# Altium schematic sheet P8_CCD_CAM_BOARD_COMM.SchDoc
size A3
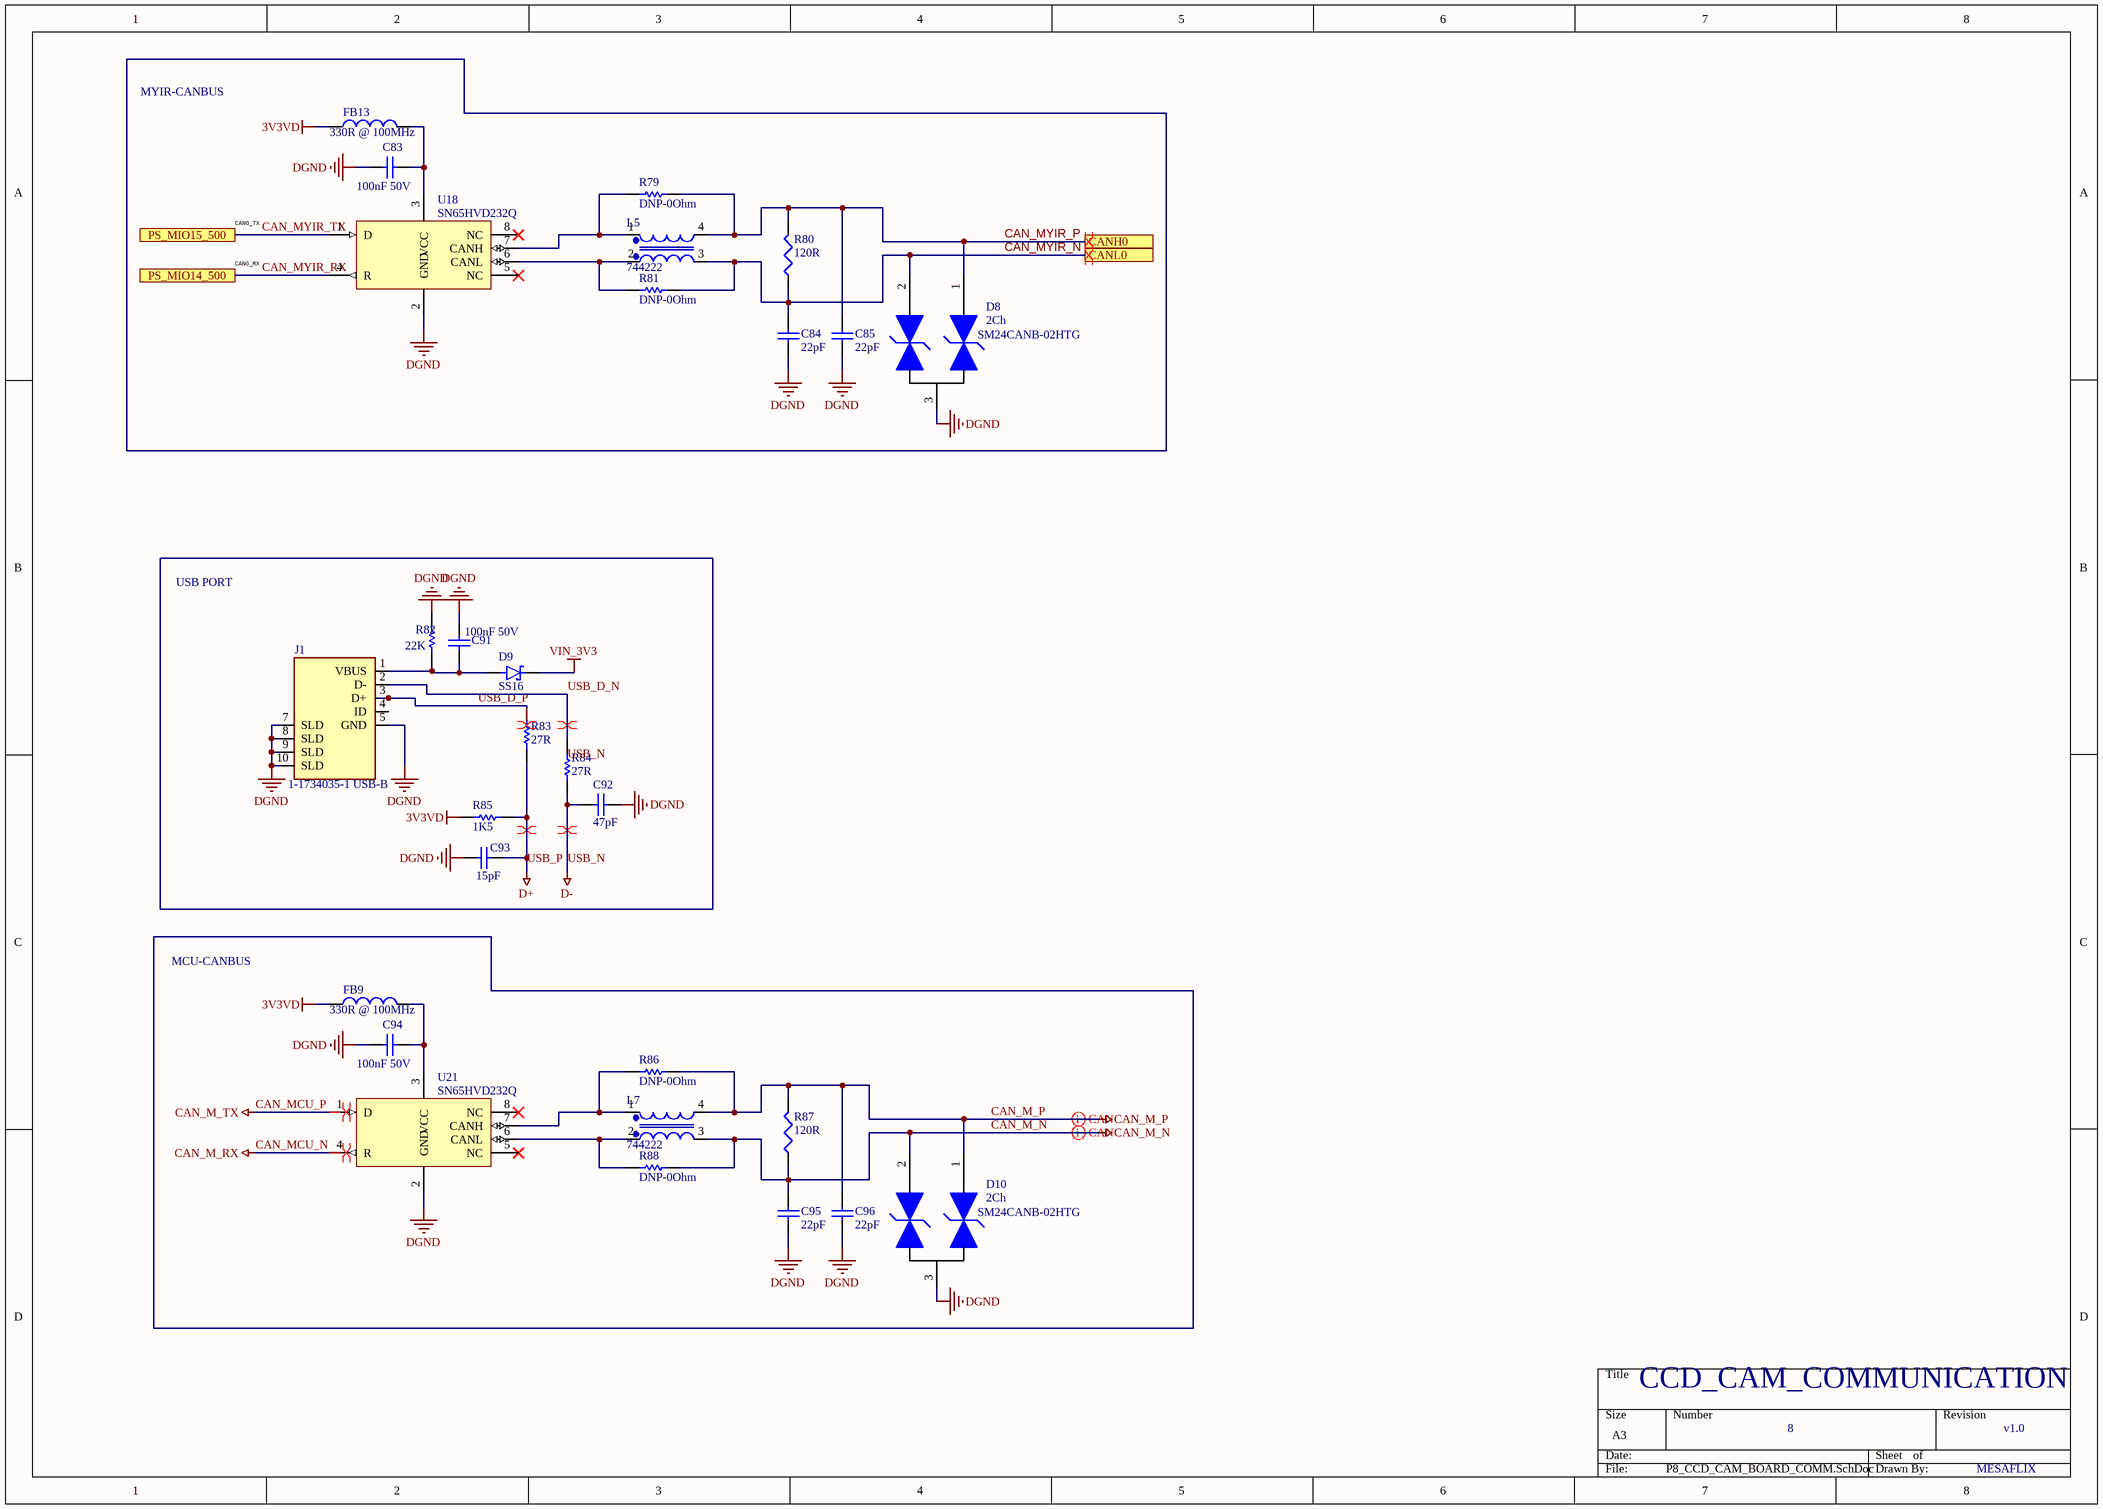
[diagram p0: P8_CCD_CAM_BOARD_COMM.SchDoc]

## Parts
C83  100nF 50V  [CAP0603]
C84  22pF  [CAP0603]
C85  22pF  [CAP0603]
C91  100nF 50V  [CAP0603]
C92  47pF  [CAP0603]
C93  15pF  [CAP0603]
C94  100nF 50V  [CAP0603]
C95  22pF  [CAP0603]
C96  22pF  [CAP0603]
D8  2Ch  P/N: SM24CANB-02HTG  [SOT23_3-DIODE]
D9  SS16  [DIOM5227X250N]
D10  2Ch  P/N: SM24CANB-02HTG  [SOT23_3-DIODE]
FB9  330R @ 100MHz  [FB0603]
FB13  330R @ 100MHz  [FB0603]
J1  1-1734035-1 USB-B  [TE_1-1734035-1-3D]
L5  744222  [IND_744222_3D]  (value not drawn)
L7  744222  [IND_744222_3D]  (value not drawn)
R79  value DNP-0Ohm  [RES0603]  (hidden comment: RES_DNP_0603)
R80  120R  [RES0603]
R81  value DNP-0Ohm  [RES0603]  (hidden comment: RES_DNP_0603)
R82  value 22K  [RES0603]  (hidden comment: RES_22K_0603)
R83  value 27R  [RES0603]  (hidden comment: RES_27R_0603)
R84  value 27R  [RES0603]  (hidden comment: RES_27R_0603)
R85  value 1K5  [RES0603]  (hidden comment: RES_1K5_0603)
R86  value DNP-0Ohm  [RES0603]  (hidden comment: RES_DNP_0603)
R87  120R  [RES0603]
R88  value DNP-0Ohm  [RES0603]  (hidden comment: RES_DNP_0603)
U18  SN65HVD232Q  [SOIC8]
U21  SN65HVD232Q  [SOIC8]

## Ports
CANH0, CANL0, PS_MIO14_500, PS_MIO15_500

## Nets
3V3VD: FB9.1 FB13.1 R85.2
CAN_M_N: C95.2 D10.2 L7.3 R87.1 R88.2
CAN_M_P: C96.2 D10.1 L7.4 R86.2 R87.2
CAN_MCU_N: U21.4(R)  [also labelled CAN_M_RX]
CAN_MCU_P: U21.1(D)  [also labelled CAN_M_TX]
DGND: C83.1 C84.1 C85.1 C91.2 C92.2 C93.2 C94.1 C95.1 C96.1 D8.3 D10.3 J1.5(GND) J1.7(SLD) J1.8(SLD) J1.9(SLD) J1.10(SLD) R82.2 U18.2(GND) U21.2(GND)
USB_N: C92.1 R84.2  [also labelled D-]
USB_P: C93.1 R83.2 R85.1  [also labelled D+]
VIN_3V3: D9.C(K)
CAN_MYIR_N: C84.2 D8.2 L5.3 R80.1 R81.2 ; port CANL0
CAN_MYIR_P: C85.2 D8.1 L5.4 R79.2 R80.2 ; port CANH0
CAN_MYIR_RX: U18.4(R) ; port PS_MIO14_500
CAN_MYIR_TX: U18.1(D) ; port PS_MIO15_500
USB_D_N: J1.2(D-) R84.1
USB_D_P: J1.3(D+) R83.1
NetC83_2: C83.2 FB13.2 U18.3(VCC)
NetC91_1: C91.1 D9.A J1.1(VBUS) R82.1
NetC94_2: C94.2 FB9.2 U21.3(VCC)
NetL5_1: L5.1 R79.1 U18.7(CANH)
NetL5_2: L5.2 R81.1 U18.6(CANL)
NetL7_1: L7.1 R86.1 U21.7(CANH)
NetL7_2: L7.2 R88.1 U21.6(CANL)

Not connected (* = marked no-connect by the designer): J1 4(ID); U18 5(NC)* 8(NC)*; U21 5(NC)* 8(NC)*

## Layout directives
differential pair; CAN: DIFF60: CAN_M_N, CAN_M_P
differential pair: CAN_MCU_N, CAN_MCU_P, CAN_MYIR_N, CAN_MYIR_P, USB_D_N, USB_D_P, USB_N, USB_P

## Notes on the sheet
- MYIR-CANBUS
- CAN0_TX
- CAN0_RX
- USB PORT
- MCU-CANBUS
- CCD_CAM_COMMUNICATION
- 8
- v1.0
- MESAFLIX
- Labels drawn without touching a wire or pin: USB_N

## Library data of the parts
C83 C91 C94 = CAP0603_100nF: CAP CER 0.1UF 50V X7R 0603; P/N: C0603C104K5RACTU; Order Code: DIGI : 399-5089-1-ND; Value: 100nF 50V
C84 C85 C95 C96 = CAP0603_22pF: CAP CER 22PF 50V C0G/NP0 0603; P/N: GRM1885C1H220JA01D; Order Code: DIGI : 490-1411-1-ND; Value: 22pF 50V
C92 = CAP0603_15pF: CAP CER 47PF 50V C0G 0603; Manufacturer: TDK Corporation; ManufacturerPartNumber: CGA3E2C0G1H470J080AA; DetailedDesctiprition: 47pF ±5% 50V Ceramic Capacitor C0G, NP0 0603 (1608 Metric); Value: 47pF 50V; DigikeyPartNumber: 445-5636-1-ND
C93 = CAP0603_15pF: CAP CER 15PF 25V C0G/NP0 0603; Manufacturer: TDK Corporation; ManufacturerPartNumber: CGA3E2C0G1H150J080AA; DetailedDesctiprition: 15pF ±5% 25V Ceramic Capacitor C0G, NP0 0603 (1608 Metric); Value: 15pF 25V; DigikeyPartNumber: 445-5630-1-ND
D8 D10 = SM24CANB-02HTG_TVS: TVS DIODE 24VWM 50VC SOT23-3; Order Code: DIGI : F6707CT-ND; Value: 2Ch
D9 = SS16: Diode Schottky 60V 1A Surface Mount SMA _DO-214AC_; MF: ON Semiconductor; MP: SS16T3G; Price: None; Value: *; Package: DO-214 ON Semiconductor; Availability: Unavailable; SnapEDA_Link: https://www.snapeda.com/parts/SS16/ON%20Semiconductor/view-part/1428535/?ref=snap; Digikey Part Number: SS16T3GOSCT-ND
FB9 FB13 = FB0603_330R@100MHz: FERRITE BEAD 330 OHM 0603 1LN; P/N: BLM18SG331TN1D; Order Code: DIGI : 490-3997-1-ND; Value: 330R @ 100MHz
J1 = 1-1734035-1: Conn Mini USB 2.0 Type B RCP 5 POS 0.8mm Solder RA SMD 5 Terminal 1 Port Tray; Centerline_Pitch: .8 mm[.031 in]; Product_Type: Connector; MF: TE Connectivity; Number_of_Positions: 5; MP: 1-1734035-1; Availability: Unavailable; Package: None; Value: *; TE_purchase_URL: https://www.te.com/usa-en/product-1-1734035-1.html?te_bu=Cor&te_type=disp&te_campaign=seda_glo_cor-seda-global-disp-prtnr-fy19-seda-model-bom-cta_sma-317_1&elqCampaignId=32493; Price: None; SnapEDA_Link: https://www.snapeda.com/parts/1-1734035-1/TE%20Connectivity%20AMP%20Connectors/view-part/1088867/?ref=snap; Digikey Part Number: A111050-ND
L5 L7 = IND_744222: Würth CMC 1MH 800MA 2LN 6 KOHM SMD; Digikey Part Number: 732-1485-1-ND; Manufacturer Part Number: 744222
R79 R81 R86 R88 = RES_1K_0603: Manufacturer: Yageo; ManufacturerPartNumber: AC0603FR-070RL; DetailedDesctiprition: 0 Ohms Jumper 0.1W, 1/10W Chip Resistor 0603 (1608 Metric) Automotive AEC-Q200, Moisture Resistant Thick Film; DigikeyPartNumber: 311-0.0LDCT-ND
R80 R87 = RES0603_120R: RES SMD 120 OHM 1% 1/10W 0603; Order Code: DIGI : 311-120HRCT-ND; P/N: RC0603FR-07120RL; ART Code: ART0023420; Value: 120R
R82 = RES_1K_0603: Manufacturer: Yageo; ManufacturerPartNumber: AC0603FR-0722KL; DetailedDesctiprition: 22 kOhms ±1% 0.1W, 1/10W Chip Resistor 0603 (1608 Metric) Automotive AEC-Q200, Moisture Resistant Thick Film; DigikeyPartNumber: 311-22KLDCT-ND
R83 R84 = RES_1K_0603: RES SMD 27 OHM 1% 1/10W 0603; Manufacturer: Yageo; ManufacturerPartNumber: RC0603FR-0727RL; DetailedDesctiprition: 27 Ohms ±1% 0.1W, 1/10W Chip Resistor 0603 (1608 Metric)  Thick Film; DigikeyPartNumber: 311-27.0HRCT-ND
R85 = RES_1K_0603: Manufacturer: Yageo; ManufacturerPartNumber: AC0603JR-071K5L; DetailedDesctiprition: 1.5 kOhms ±5% 0.1W, 1/10W Chip Resistor 0603 (1608 Metric) Automotive AEC-Q200, Moisture Resistant Thick Film; DigikeyPartNumber: YAG3645CT-ND
U18 U21 = SN65HVD232QDRQ1_CAN: IC TRANSCEIVER HALF 1/1 8SOIC; Order Code: DIGI : 296-15381-1-ND; Value: CAN; P/N: SN65HVD232QDRQ1